# EAGLE design board3 (EAGLE 9.6.2)
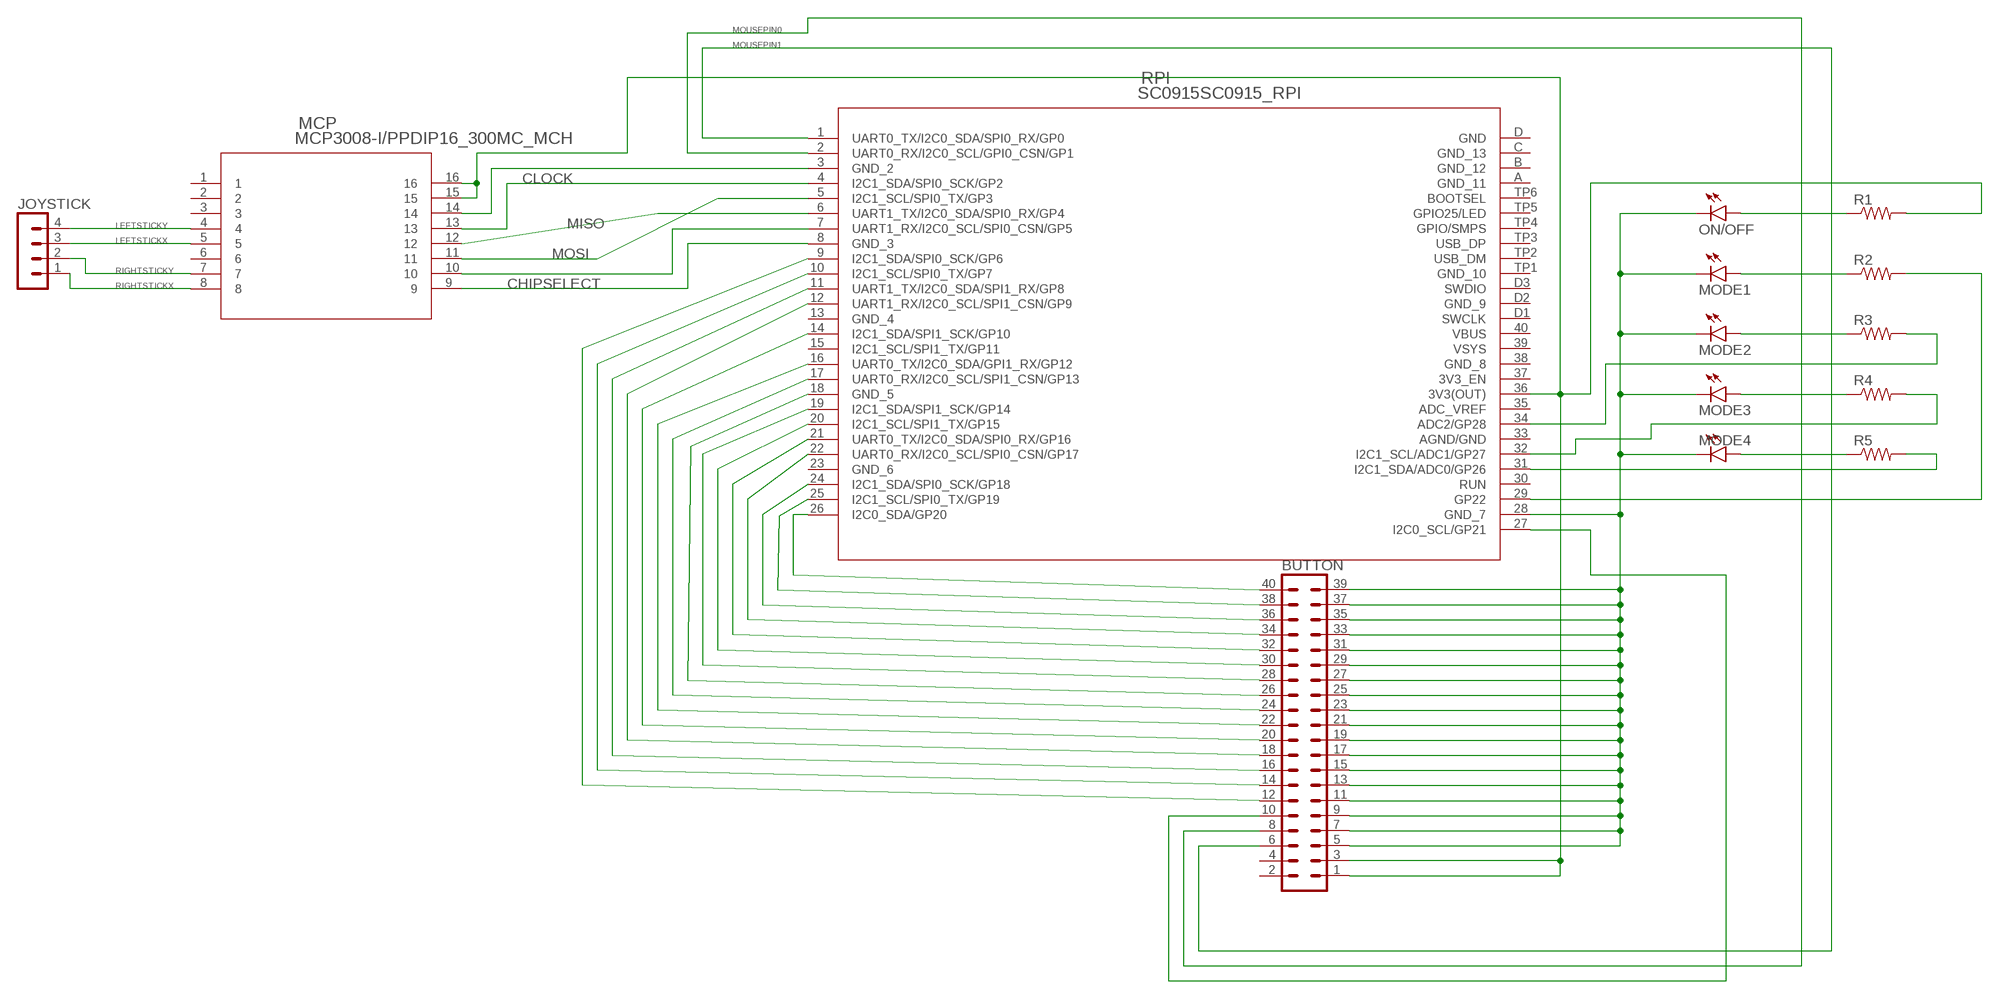
[diagram p0: schematic, sheet 1]

## Parts
BUTTON  MA20-2  [MA20-2]
JOYSTICK  MA04-1  [MA04-1]
MCP  MCP3008-I/PPDIP16_300MC_MCH  [PDIP16_300MC_MCH]
MODE1  LED5MM  [LED5MM]
MODE2  LED5MM  [LED5MM]
MODE3  LED5MM  [LED5MM]
MODE4  LED5MM  [LED5MM]
ON/OFF  LED5MM  [LED5MM]
R1  R-US_0617/17  [0617/17]
R2  R-US_0617/17  [0617/17]
R3  R-US_0617/17  [0617/17]
R4  R-US_0617/17  [0617/17]
R5  R-US_0617/17  [0617/17]
RPI  SC0915SC0915_RPI  [SC0915_RPI]

## Nets
CHIPSELECT: MCP.10 RPI.7(UART1_RX/I2C0_SCL/SPI0_CSN/GP5)
CLOCK: MCP.13 RPI.4(I2C1_SDA/SPI0_SCK/GP2)
GND: BUTTON.5 BUTTON.7 BUTTON.9 BUTTON.11 BUTTON.13 BUTTON.15 BUTTON.17 BUTTON.19 BUTTON.21 BUTTON.23 BUTTON.25 BUTTON.27 BUTTON.29 BUTTON.31 BUTTON.33 BUTTON.35 BUTTON.37 BUTTON.39 MODE1.K(C) MODE2.K(C) MODE3.K(C) MODE4.K(C) ON/OFF.K(C) RPI.28(GND_7)
LEFTSTICKX: JOYSTICK.3 MCP.5
LEFTSTICKY: JOYSTICK.4 MCP.4
MISO: MCP.12 RPI.6(UART1_TX/I2C0_SDA/SPI0_RX/GP4)
MOSI: MCP.11 RPI.5(I2C1_SCL/SPI0_TX/GP3)
MOUSEPIN0: BUTTON.8 RPI.2(UART0_RX/I2C0_SCL/GPI0_CSN/GP1)
MOUSEPIN1: BUTTON.6 RPI.1(UART0_TX/I2C0_SDA/SPI0_RX/GP0)
N$1: BUTTON.36 RPI.24(I2C1_SDA/SPI0_SCK/GP18)
N$2: BUTTON.38 RPI.25(I2C1_SCL/SPI0_TX/GP19)
N$3: BUTTON.26 RPI.18(GND_5)
N$4: BUTTON.40 RPI.26(I2C0_SDA/GP20)
N$5: MCP.9 RPI.8(GND_3)
N$6: BUTTON.10 RPI.27(I2C0_SCL/GP21)
N$7: MCP.14 RPI.3(GND_2)
N$8: ON/OFF.A R1.1
N$9: BUTTON.12 RPI.9(I2C1_SDA/SPI0_SCK/GP6)
N$10: BUTTON.14 RPI.10(I2C1_SCL/SPI0_TX/GP7)
N$11: BUTTON.16 RPI.11(UART1_TX/I2C0_SDA/SPI1_RX/GP8)
N$12: BUTTON.18 RPI.12(UART1_RX/I2C0_SCL/SPI1_CSN/GP9)
N$13: BUTTON.20 RPI.14(I2C1_SDA/SPI1_SCK/GP10)
N$14: BUTTON.22 RPI.16(UART0_TX/I2C0_SDA/GPI1_RX/GP12)
N$15: BUTTON.24 RPI.17(UART0_RX/I2C0_SCL/SPI1_CSN/GP13)
N$16: BUTTON.28 RPI.19(I2C1_SDA/SPI1_SCK/GP14)
N$17: BUTTON.30 RPI.20(I2C1_SCL/SPI1_TX/GP15)
N$18: BUTTON.32 RPI.21(UART0_TX/I2C0_SDA/SPI0_RX/GP16)
N$19: BUTTON.34 RPI.22(UART0_RX/I2C0_SCL/SPI0_CSN/GP17)
N$20: MODE1.A R2.1
N$21: MODE2.A R3.1
N$22: MODE3.A R4.1
N$23: MODE4.A R5.1
N$24: BUTTON.1 BUTTON.3 MCP.15 MCP.16 R1.2 RPI.36(3V3(OUT))
N$25: R2.2 RPI.29(GP22)
N$26: R3.2 RPI.34(ADC2/GP28)
N$27: R4.2 RPI.32(I2C1_SCL/ADC1/GP27)
N$28: R5.2 RPI.31(I2C1_SDA/ADC0/GP26)
RIGHTSTICKX: JOYSTICK.1 MCP.8
RIGHTSTICKY: JOYSTICK.2 MCP.7
Unconnected: BUTTON.2 BUTTON.4 MCP.1 MCP.2 MCP.3 MCP.6 RPI.13(GND_4) RPI.15(I2C1_SCL/SPI1_TX/GP11) RPI.23(GND_6) RPI.30(RUN) RPI.33(AGND/GND) RPI.38(GND_8) RPI.A(GND_11) RPI.B(GND_12) RPI.C(GND_13) RPI.D1(SWCLK) RPI.D2(GND_9) RPI.D3(SWDIO) RPI.D(GND) RPI.TP1(GND_10) RPI.TP2(USB_DM) RPI.TP3(USB_DP) RPI.TP4(GPIO/SMPS) RPI.TP5(GPIO25/LED) RPI.TP6(BOOTSEL)

## Power pins joined to a net without a drawn wire
3V3_EN: RPI.37(3V3_EN)
ADC_VREF: RPI.35(ADC_VREF)
VBUS: RPI.40(VBUS)
VSYS: RPI.39(VSYS)

## Library data of the parts
BUTTON = con-lstb:MA20-2: PIN HEADER; OC_FARNELL: unknown; OC_NEWARK: unknown
JOYSTICK = con-lstb:MA04-1: PIN HEADER; OC_FARNELL: unknown; OC_NEWARK: unknown
MCP = 2022-10-25_19-18-53_Library:MCP3008-I/P; COPYRIGHT: Copyright (C) 2022 Ultra Librarian. All rights reserved.; DIGI-KEY_PART_NUMBER_1: MCP3008-I/P-ND; MANUFACTURER_PART_NUMBER: MCP3008-I/P; MFR_NAME: Microchip
MODE1-MODE4 ON/OFF = led:LED: LED OSRAM: - CHIPLED LG R971, LG N971, LY N971, LG Q971, LY Q971, LO R971, LY R971 LH N974, LH R974 LS Q976, LO Q976, LY Q976 LO Q996 - Hyper CHIPLED LW Q18S LB Q993, LB Q99A, LB R99A - SideLED LS A670, LO A670, LY A670, LG A670, LP A670 LB A673, LV A673, LT A673, LW A673 LH A674 LY A675 LS A676, LA A676, LO A676, LY A676, LW A676 LS A679, LY A679, LG A679 - Hyper Micro SIDELED® LS Y876, LA Y876, LO Y876, LY Y876 LT Y87S - SmartLED LW L88C, LW L88S LB L89C, LB L89S, LG L890 LS L89K, LO L89K, LY L89K LS L896, LA L896, LO L896, LY L896 - TOPLED LS T670, LO T670, LY T670, LG T670, LP T670 LSG T670, LSP T670, LSY T670, LOP T670, LYG T670 LG T671, LOG T671, LSG T671 LB T673, LV T673, LT T673, LW T673 LH T674 LS T676, LA T676, LO T676, LY T676, LB T676, LH T676, LSB T676, LW T676 LB T67C, LV T67C, LT T67C, LS T67K, LO T67K, LY T67K, LW E67C LS E67B, LA E67B, LO E67B, LY E67B, LB E67C, LV E67C, LT E67C LW T67C LS T679, LY T679, LG T679 LS T770, LO T770, LY T770, LG T770, LP T770 LB T773, LV T773, LT T773, LW T773 LH T774 LS E675, LA E675, LY E675, LS T675 LS T776, LA T776, LO T776, LY T776, LB T776 LHGB T686 LT T68C, LB T68C - Hyper Mini TOPLED® LB M676 - Mini TOPLED Santana® LG M470 LS M47K, LO M47K, LY M47K Source: http://www.osram.convergy.de LUXEON: - LUMILED® LXK2-PW12-R00, LXK2-PW12-S00, LXK2-PW14-U00, LXK2-PW14-V00 LXK2-PM12-R00, LXK2-PM12-S00, LXK2-PM14-U00 LXK2-PE12-Q00, LXK2-PE12-R00, LXK2-PE12-S00, LXK2-PE14-T00, LXK2-PE14-U00 LXK2-PB12-K00, LXK2-PB12-L00, LXK2-PB12-M00, LXK2-PB14-N00, LXK2-PB14-P00, LXK2-PB14-Q00 LXK2-PR12-L00, LXK2-PR12-M00, LXK2-PR14-Q00, LXK2-PR14-R00 LXK2-PD12-Q00, LXK2-PD12-R00, LXK2-PD12-S00 LXK2-PH12-R00, LXK2-PH12-S00 LXK2-PL12-P00, LXK2-PL12-Q00, LXK2-PL12-R00 Source: www.luxeon.com KINGBRIGHT: KA-3528ASYC Source: www.kingbright.com
R1-R5 = rcl:R-US_: RESISTOR, American symbol; SPICEPREFIX: R
RPI = 2022-10-25_19-15-06_Library:SC0915; COPYRIGHT: Copyright (C) 2022 Ultra Librarian. All rights reserved.; MANUFACTURER_PART_NUMBER: SC0915; MFR_NAME: Raspberry Pi

## Board
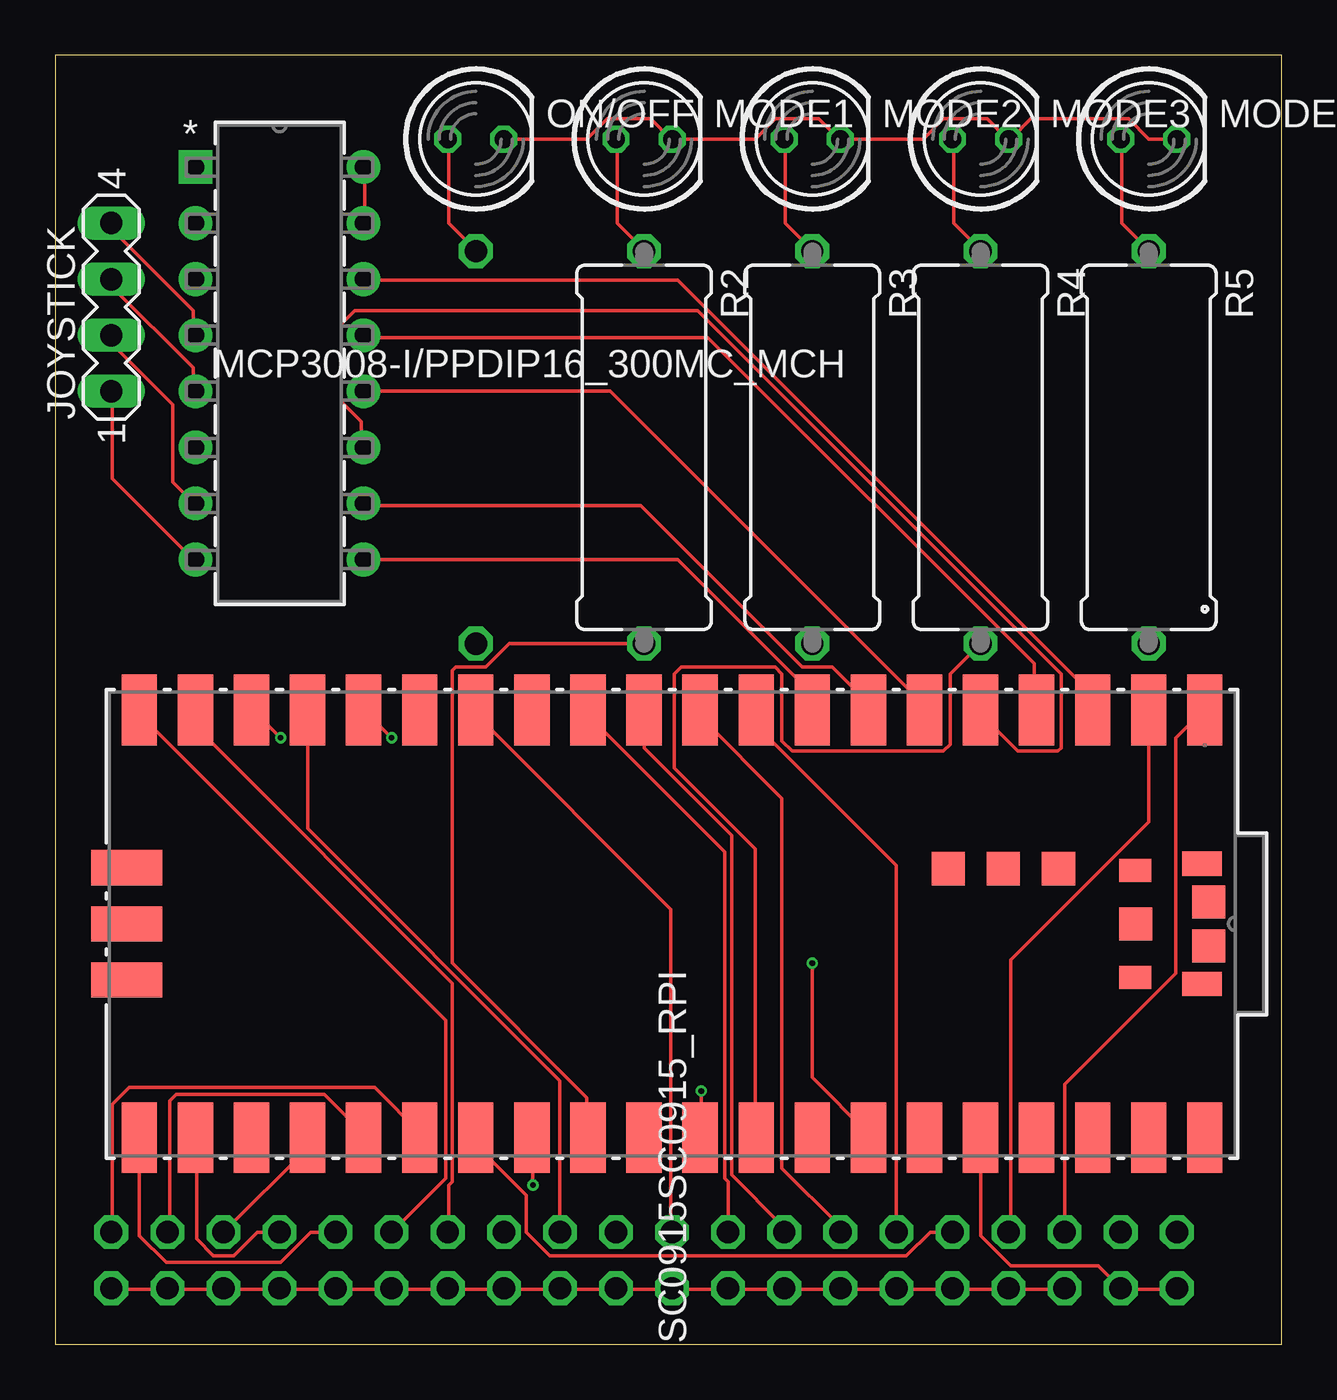
[diagram p1: board, top side]
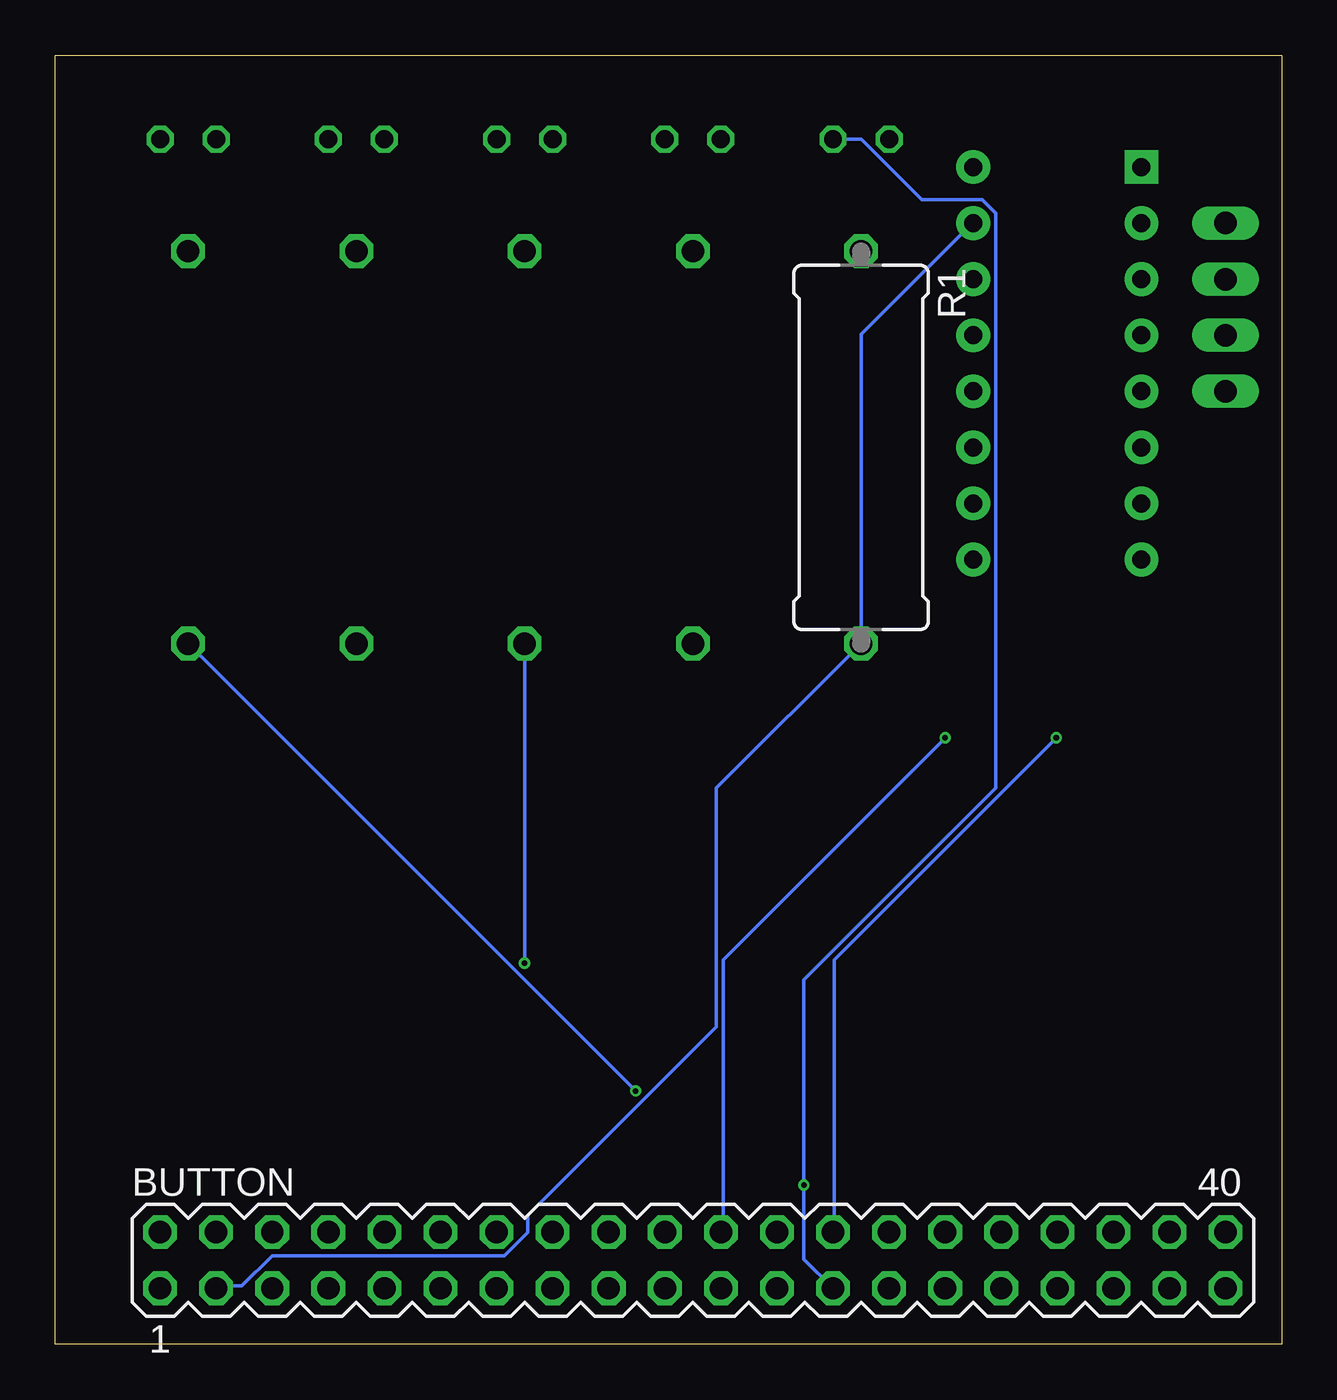
[diagram p2: board, bottom side, seen from below]

Size 55.55 x 58.41 mm. Coordinates in mm from the lower left corner, seen from the top.
Outline: 0,0 55.55,0 55.55,58.41 0,58.41 0,0
Copper layers (1*16): Top 0.035559375mm / dielectric 1.6mm / Bottom 0.035559375mm
Design rules "oshpark-2layer": minimum track width 6mil, minimum drill 10mil, track to track 6mil, track to pad 6mil, pad to pad 6mil, via to via 6mil, smd to smd 6mil, copper to edge 15mil, drill to drill 6mil, minimum pad ring 5mil, minimum via ring 5mil, stop-mask expansion 2.5mil, vias tented up to drill 0mil, thermal gap 10mil

### Footprints (pad centres in the part's own frame; a part is rotated, then mirrored left to right if it is on the bottom)
MA20-2 = drill 1.016 octagon: 1 -24.13,-1.27; 2 -24.13,1.27; 3 -21.59,-1.27; 4 -21.59,1.27; 5 -19.05,-1.27; 6 -19.05,1.27; 7 -16.51,-1.27; 8 -16.51,1.27; 9 -13.97,-1.27; 10 -13.97,1.27; 11 -11.43,-1.27; 12 -11.43,1.27; 13 -8.89,-1.27; 14 -8.89,1.27; 15 -6.35,-1.27; 16 -6.35,1.27; 17 -3.81,-1.27; 18 -3.81,1.27; 19 -1.27,-1.27; 20 -1.27,1.27; 21 1.27,-1.27; 22 1.27,1.27; 23 3.81,-1.27; 24 3.81,1.27; 25 6.35,-1.27; 26 6.35,1.27; 27 8.89,-1.27; 28 8.89,1.27; 29 11.43,-1.27; 30 11.43,1.27; 31 13.97,-1.27; 32 13.97,1.27; 33 16.51,-1.27; 34 16.51,1.27; 35 19.05,-1.27; 36 19.05,1.27; 37 21.59,-1.27; 38 21.59,1.27; 39 24.13,-1.27; 40 24.13,1.27
MA04-1 = drill 1.016 long: 1 -3.81,0; 2 -1.27,0; 3 1.27,0; 4 3.81,0
PDIP16_300MC_MCH = drill 0.813 pad 1.524 square: 1 0,0 | drill 0.813 pad 1.524: 2 0,-2.54; 3 0,-5.08; 4 0,-7.62; 5 0,-10.16; 6 0,-12.7; 7 0,-15.24; 8 0,-17.78; 9 7.62,-17.78; 10 7.62,-15.24; 11 7.62,-12.7; 12 7.62,-10.16; 13 7.62,-7.62; 14 7.62,-5.08; 15 7.62,-2.54; 16 7.62,0
LED5MM = drill 0.813 octagon: A -1.27,0; K 1.27,0
0617/17 = drill 1.016 octagon: 1 -8.89,0; 2 8.89,0
SC0915_RPI = smd 3.2 x 1.6: 1 -9.69,24.13; 2 -9.69,21.59; 3 -9.69,19.05; 4 -9.69,16.51; 5 -9.69,13.97; 6 -9.69,11.43; 7 -9.69,8.89; 8 -9.69,6.35; 9 -9.69,3.81; 10 -9.69,1.27; 11 -9.69,-1.27; 12 -9.69,-3.81; 13 -9.69,-6.35; 14 -9.69,-8.89; 15 -9.69,-11.43; 16 -9.69,-13.97; 17 -9.69,-16.51; 18 -9.69,-19.05; 19 -9.69,-21.59; 20 -9.69,-24.13; 21 9.69,-24.13; 22 9.69,-21.59; 23 9.69,-19.05; 24 9.69,-16.51; 25 9.69,-13.97; 26 9.69,-11.43; 27 9.69,-8.89; 28 9.69,-6.35; 29 9.69,-3.81; 30 9.69,-1.27; 31 9.69,1.27; 32 9.69,3.81; 33 9.69,6.35; 34 9.69,8.89; 35 9.69,11.43; 36 9.69,13.97; 37 9.69,16.51; 38 9.69,19.05; 39 9.69,21.59; 40 9.69,24.13 | smd 1.092 x 1.803: A -2.725,24; B 2.725,24 | smd 1.041 x 1.448: C -2.426,20.97; D 2.426,20.97 | smd 1.6 x 3.2: D1 -2.54,-24.699; D2 0,-24.699; D3 2.54,-24.699 | smd 1.499 x 1.499: TP1 0,21.001; TP2 1.001,24.3; TP3 -1.001,24.3; TP4 -2.499,17.501; TP5 -2.499,15.001; TP6 -2.499,12.502

### Placement (x,y rotation side)
BUTTON  26.67,3.81 0 bottom
JOYSTICK  2.54,46.99 90 top
MCP  6.35,53.34 0 top
MODE1  26.67,54.61 0 top
MODE2  34.29,54.61 0 top
MODE3  41.91,54.61 0 top
MODE4  49.53,54.61 0 top
ON/OFF  19.05,54.61 0 top
R1  19.05,40.64 270 bottom
R2  26.67,40.64 270 top
R3  34.29,40.64 270 top
R4  41.91,40.64 270 top
R5  49.53,40.64 270 top
RPI  27.94,19.05 270 top

### Tracks (layer width: path | path; a pad name or v marks a point on that pad's centre or on a via)
CHIPSELECT
  Top 0.152: MCP.10 14.02,38 26.52,38 33.83,30.68 35.2,30.68 36.73,29.16 36.73,28.85 RPI.7
CLOCK
  Top 0.152: MCP.13 14.02,45.62 29.57,45.62 44.35,30.84 44.35,28.85 RPI.4
GND  (via drill 0.25)
  Top 0.152: ON/OFF.K 24.08,54.61 24.99,55.52 26.98,55.52 27.89,54.61 MODE1.K 31.7,54.61 32.61,55.52 34.59,55.52 35.51,54.61 MODE2.K 39.32,54.61 40.23,55.52 42.22,55.52 43.13,54.61 MODE3.K 43.28,54.61 44.2,55.52 48.62,55.52 49.53,54.61 MODE4.K | BUTTON.39 2.59,2.49 5.03,2.49 BUTTON.37 5.18,2.49 7.62,2.49 | 15.24,2.49 12.8,2.49 BUTTON.31 12.65,2.49 10.21,2.49 BUTTON.33 10.06,2.49 7.62,2.49 | 7.62,2.49 BUTTON.35 | 22.86,2.49 20.42,2.49 BUTTON.25 20.27,2.49 17.83,2.49 BUTTON.27 17.68,2.49 15.24,2.49 | v21.64,7.21 21.64,9.35 RPI.28 | BUTTON.5 45.72,2.49 43.28,2.49 BUTTON.7 43.13,2.49 40.69,2.49 BUTTON.9 40.54,2.49 38.1,2.49 | 30.48,2.49 28.04,2.49 BUTTON.19 27.89,2.49 25.45,2.49 BUTTON.21 25.3,2.49 22.86,2.49 | 38.1,2.49 35.66,2.49 BUTTON.13 35.51,2.49 33.07,2.49 BUTTON.15 32.92,2.49 30.48,2.49 | 30.48,2.49 BUTTON.17 | 38.1,2.49 BUTTON.11 | 22.86,2.49 BUTTON.23 | 15.24,2.49 BUTTON.29
  Bottom 0.152: BUTTON.25 21.64,3.86 v21.64,7.21 21.64,16.51 12.95,25.2 12.95,51.26 13.56,51.87 16.31,51.87 19.05,54.61 ON/OFF.K
LEFTSTICKX
  Top 0.152: JOYSTICK.3 2.59,48.21 2.59,47.9 6.25,44.25 6.25,43.18 MCP.5
LEFTSTICKY
  Top 0.152: JOYSTICK.4 2.59,50.8 2.59,50.49 6.25,46.84 6.25,45.77 MCP.4
MISO
  Top 0.152: MCP.12 25.15,43.18 39.47,28.85 RPI.6
MOSI
  Top 0.152: RPI.5 41.91,28.55 43.59,26.87 45.41,26.87 45.57,27.03 45.57,30.38 29.11,46.84 13.56,46.84 12.95,46.23 12.95,42.72 13.87,41.81 13.87,40.74 MCP.11
MOUSEPIN0
  Top 0.152: RPI.2 49.53,23.67 43.28,17.42 43.28,5.08 BUTTON.8
MOUSEPIN1
  Top 0.152: BUTTON.6 45.72,11.79 50.75,16.82 50.75,27.48 51.97,28.7 RPI.1
N$1
  Top 0.152: BUTTON.36 11.43,8.89 RPI.24
N$2
  Top 0.152: BUTTON.38 5.18,5.08 5.18,11.02 5.49,11.33 12.19,11.33 14.02,9.5 RPI.25
N$3  (via drill 0.25)
  Top 0.152: v10.21,27.48 8.99,28.7 RPI.18
  Bottom 0.152: v10.21,27.48 20.27,17.42 20.27,5.08 BUTTON.26
N$4
  Top 0.152: BUTTON.40 2.59,5.08 2.59,10.87 3.35,11.63 14.48,11.63 16.61,9.5 RPI.26
N$5
  Top 0.152: MCP.9 28.19,35.56 34.29,29.46 RPI.8
N$6
  Top 0.152: BUTTON.10 39.62,5.08 38.56,4.01 22.4,4.01 21.34,5.08 21.34,6.76 19.05,9.04 RPI.27
N$7
  Top 0.152: MCP.14 14.02,48.21 28.19,48.21 46.94,29.46 46.94,28.85 RPI.3
N$8
  Top 0.152: ON/OFF.A 17.83,54.61 17.83,50.8 19.05,49.58 R1.1
N$9
  Top 0.152: BUTTON.12 38.1,21.69 31.85,27.94 31.85,28.7 RPI.9
N$10
  Top 0.152: BUTTON.14 35.51,5.08 35.51,5.39 32.92,7.98 32.92,24.74 29.26,28.4 29.26,28.7 RPI.10
N$11
  Top 0.152: RPI.11 26.67,27.03 30.63,23.06 30.63,7.67 32.92,5.39 32.92,5.08 BUTTON.16
N$12
  Top 0.152: BUTTON.18 30.48,7.37 30.33,7.52 30.33,22.3 24.23,28.4 24.23,28.7 RPI.12
N$13
  Top 0.152: RPI.14 19.05,28.55 27.89,19.71 27.89,5.08 BUTTON.20
N$14  (via drill 0.25)
  Top 0.152: v15.24,27.48 14.02,28.7 RPI.16
  Bottom 0.152: v15.24,27.48 25.3,17.42 25.3,5.08 BUTTON.22
N$15
  Top 0.152: BUTTON.24 22.86,11.94 11.43,23.37 RPI.17
N$16
  Top 0.152: BUTTON.28 17.83,5.08 17.83,7.21 17.98,7.37 17.98,16.36 6.4,27.94 6.4,28.7 RPI.19
N$17
  Top 0.152: BUTTON.30 17.68,7.52 17.68,14.68 3.81,28.55 RPI.20
N$18
  Top 0.152: BUTTON.32 11.58,5.08 10.21,3.71 5.03,3.71 3.81,4.93 RPI.21
N$19
  Top 0.152: BUTTON.34 9.14,5.08 8.08,4.01 7.16,4.01 6.4,4.77 6.4,9.35 RPI.22
N$20
  Top 0.152: MODE1.A 25.45,54.61 25.45,50.8 26.67,49.58 R2.1
N$21
  Top 0.152: MODE2.A 33.07,54.61 33.07,50.8 34.29,49.58 R3.1
N$22
  Top 0.152: MODE3.A 40.69,54.61 40.69,50.8 41.91,49.58 R4.1
N$23
  Top 0.152: MODE4.A 48.31,54.61 48.31,50.8 49.53,49.58 R5.1
N$24
  Top 0.152: BUTTON.1 50.75,2.49 48.31,2.49 BUTTON.3 47.24,3.56 43.28,3.56 41.91,4.93 RPI.36 | MCP.16 14.02,53.24 14.02,50.8 MCP.15
  Bottom 0.152: MCP.15 14.02,50.8 19.05,45.77 R1.2 25.6,25.2 25.6,14.38 34.14,5.84 34.14,5.08 35.2,4.01 45.72,4.01 47.09,2.64 48.16,2.64 BUTTON.3
N$25
  Top 0.152: R2.2 20.57,31.75 19.51,30.68 18.14,30.68 17.98,30.53 17.98,17.27 24.08,11.18 24.08,9.5 RPI.29
N$26  (via drill 0.25)
  Top 0.152: v34.29,17.27 34.29,12.09 36.88,9.5 RPI.34
  Bottom 0.152: v34.29,17.27 R3.2
N$27
  Top 0.152: R4.2 40.54,30.38 40.54,27.18 40.23,26.87 33.38,26.87 32.92,27.33 32.92,30.38 32.61,30.68 28.35,30.68 28.04,30.38 28.04,26.11 31.7,22.45 31.7,9.5 RPI.32
N$28  (via drill 0.25)
  Top 0.152: v29.26,11.48 29.26,9.5 RPI.31
  Bottom 0.152: v29.26,11.48 R5.2
RIGHTSTICKX
  Top 0.152: JOYSTICK.1 2.59,43.18 2.59,39.22 6.25,35.56 MCP.8
RIGHTSTICKY
  Top 0.152: JOYSTICK.2 2.59,45.62 2.59,45.31 5.33,42.57 5.33,39.06 6.25,38.15 MCP.7